# EAGLE board Main (EAGLE 9.6.2), part 1 of 2
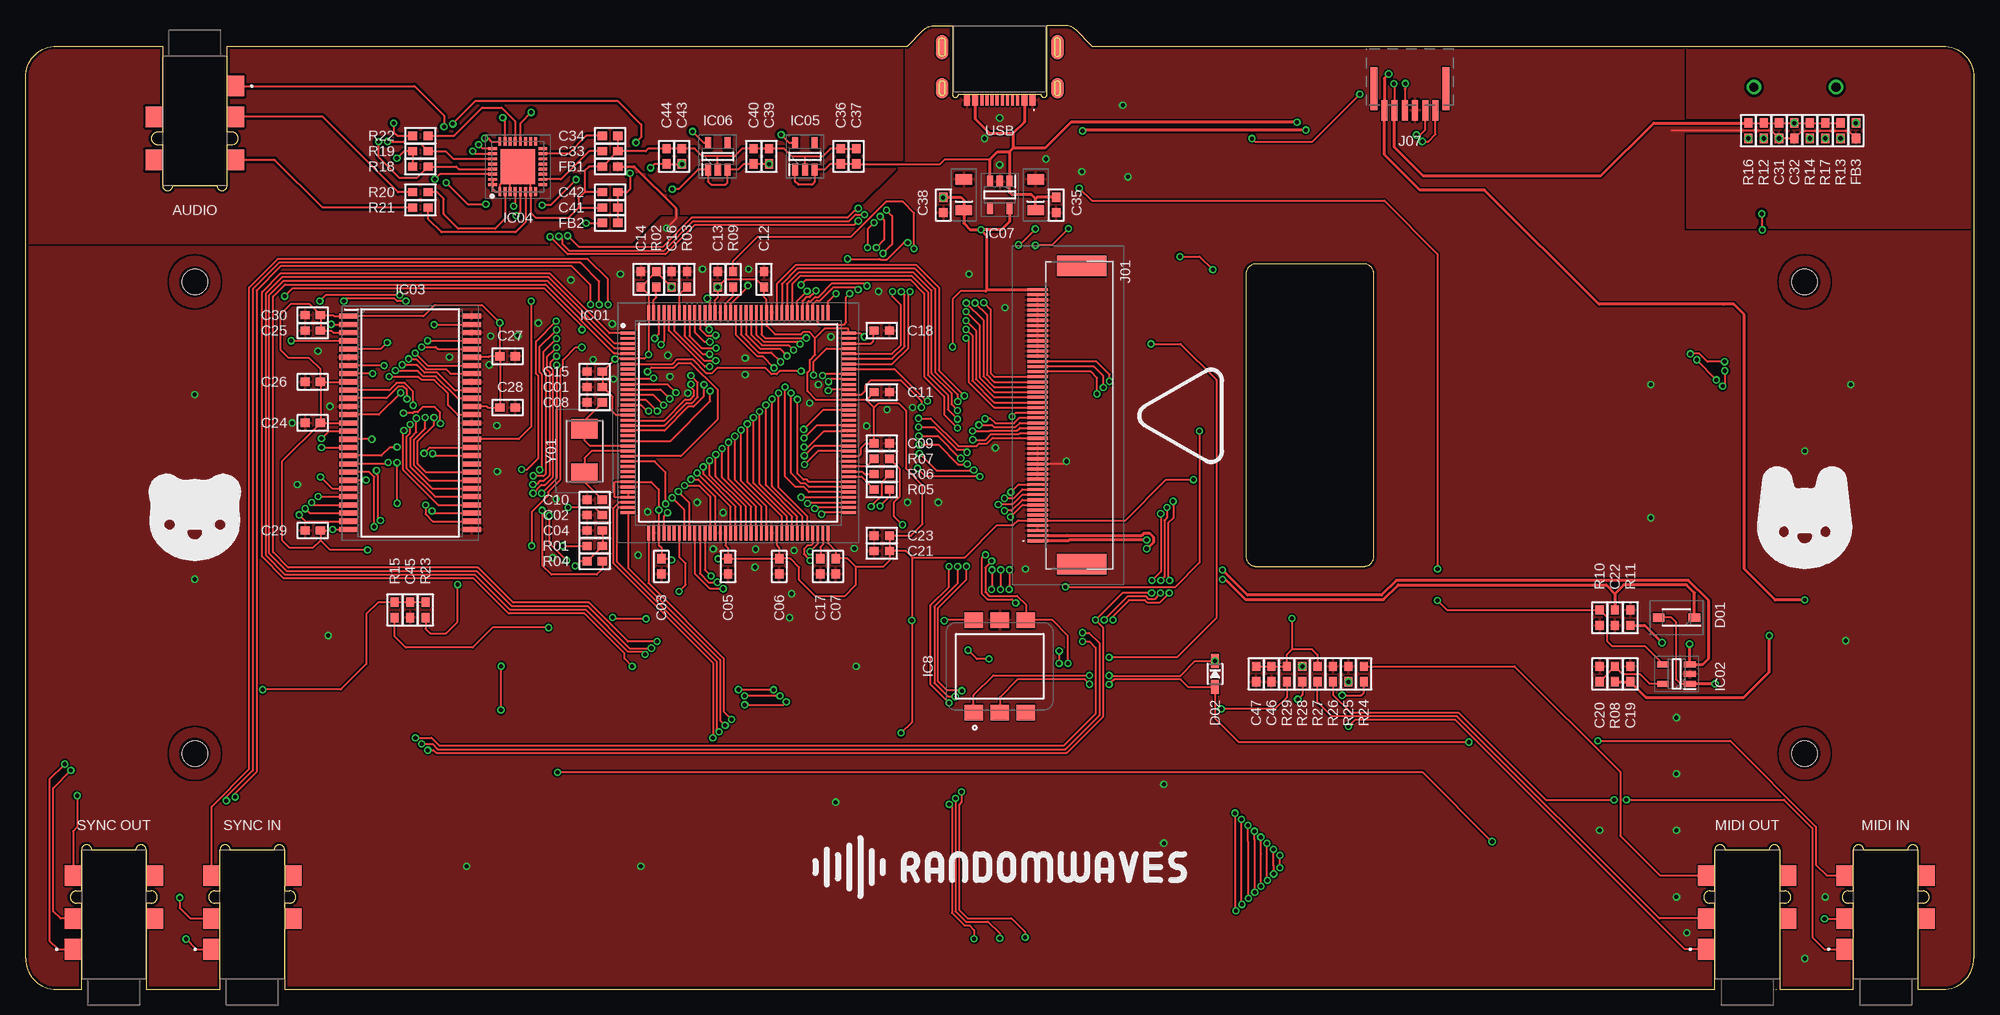
[diagram p5: board, top side]
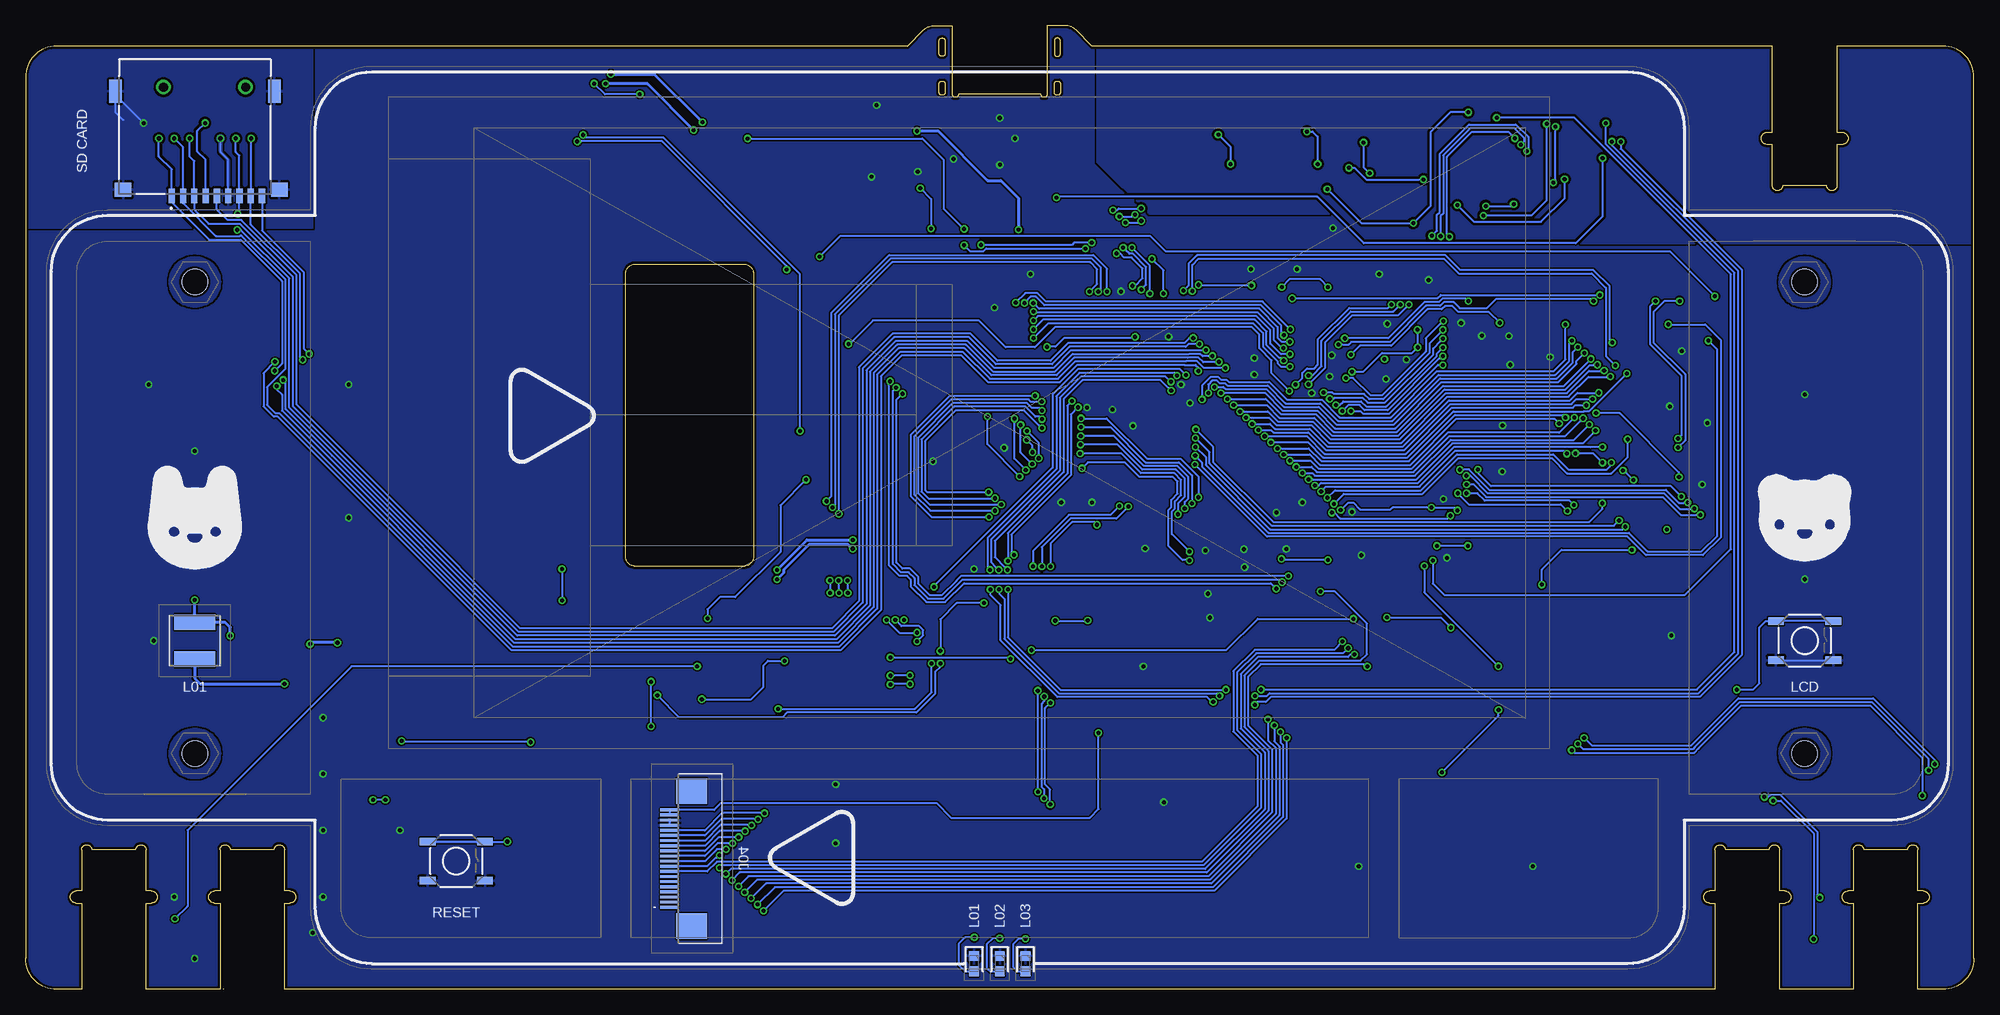
[diagram p6: board, bottom side, seen from below]

Size 190 x 94 mm. Coordinates in mm from the lower left corner, seen from the top.
Outline: 170.7,0 170.75,0
Outline: 119,42.25 arc90 120,41.25 130.5,41.25 arc90 131.5,42.25 131.5,69.75 arc90 130.5,70.75 120,70.75 arc90 119,69.75 119,42.25
Outline: 187,92 arc-90 190,89 190,3 arc-90 187,0 184.55,0 184.55,8.4 185.05,8.4 arc180 185.05,9.6 184.55,9.6 184.55,13.6 arc180 183.55,13.6 179.25,13.6 arc180 178.25,13.6 178.25,9.6 177.75,9.6 arc180 177.75,8.4 178.25,8.4 178.25,0 171.05,0 171.05,8.4 171.55,8.4 arc180 171.55,9.6 171.05,9.6 171.05,13.6 arc180 170.05,13.6 165.75,13.6 arc180 164.75,13.6 164.75,9.6 164.25,9.6 arc180 164.25,8.4 164.75,8.4 164.75,0 25.25,0 25.25,8.4 25.75,8.4 arc180 25.75,9.6 25.25,9.6 25.25,13.6 arc180 24.25,13.6 19.95,13.6 arc180 18.95,13.6 18.95,9.6 18.45,9.6 arc180 18.45,8.4 18.95,8.4 18.95,0 11.75,0 11.75,8.4 12.25,8.4 arc180 12.25,9.6 11.75,9.6 11.75,13.6 arc180 10.75,13.6 6.45,13.6 arc180 5.45,13.6 5.45,9.6 4.95,9.6 arc180 4.95,8.4 5.45,8.4 5.45,0 3,0 arc-90 0,3 0,89 arc-90 3,92 13.35,92 13.35,83.6 12.85,83.6 arc180 12.85,82.4 13.35,82.4 13.35,78.4 arc180 14.35,78.4 18.65,78.4 arc180 19.65,78.4 19.65,82.4 20.15,82.4 arc180 20.15,83.6 19.65,83.6 19.65,92 86,92 87.59,93.59 arc-45 88.58,94 90.38,94 90.38,87.3 arc90 90.68,87 arc90 90.98,87.3 99.02,87.3 arc90 99.32,87 arc90 99.62,87.3 99.62,94 101.42,94 arc-45 102.41,93.59 104,92 187,92
Copper layers (1*16): Top 0.035mm / dielectric 1.5mm / Bottom 0.035mm
Design rules "ITEADstudio_DRC": minimum track width 6mil, minimum drill 12mil, track to track 6mil, track to pad 6mil, pad to pad 6mil, via to via 6mil, smd to smd 0mil, copper to edge 10mil, drill to drill 10mil, minimum pad ring 10mil, minimum via ring 6mil, stop-mask expansion 2mil, vias tented up to drill 100mil, thermal gap 10mil
Holes 2.5 mm at 173.5,69 16.5,69 173.5,23 16.5,23

## Footprints (pad centres in the part's own frame; a part is rotated, then mirrored left to right if it is on the bottom)
CAP-0603 = smd 0.9 x 0.8: P$1 -0.75,0; P$2 0.75,0
CAP-POL-1206 = smd 1 x 1.6: P$1 -1.5,0; P$2 1.5,0
SOD3716X135N = smd 1.15 x 0.8: 1 -1.75,0; 2 1.75,0
SOD-323 = smd 1.35 x 0.8: A 1.27,0; C -1.27,0
RES-0603 = smd 0.9 x 0.8: P$1 -0.75,0; P$2 0.75,0
QFP50P2200X2200X160-144N = smd 1.475 x 0.275: 1 -10.738,8.75; 2 -10.738,8.25; 3 -10.738,7.75; 4 -10.738,7.25; 5 -10.738,6.75; 6 -10.738,6.25; 7 -10.738,5.75; 8 -10.738,5.25; 9 -10.738,4.75; 10 -10.738,4.25; 11 -10.738,3.75; 12 -10.738,3.25; 13 -10.738,2.75; 14 -10.738,2.25; 15 -10.738,1.75; 16 -10.738,1.25; 17 -10.738,0.75; 18 -10.738,0.25; 19 -10.738,-0.25; 20 -10.738,-0.75; 21 -10.738,-1.25; 22 -10.738,-1.75; 23 -10.738,-2.25; 24 -10.738,-2.75; 25 -10.738,-3.25; 26 -10.738,-3.75; 27 -10.738,-4.25; 28 -10.738,-4.75; 29 -10.738,-5.25; 30 -10.738,-5.75; 31 -10.738,-6.25; 32 -10.738,-6.75; 33 -10.738,-7.25; 34 -10.738,-7.75; 35 -10.738,-8.25; 36 -10.738,-8.75; 73 10.738,-8.75; 74 10.738,-8.25; 75 10.738,-7.75; 76 10.738,-7.25; 77 10.738,-6.75; 78 10.738,-6.25; 79 10.738,-5.75; 80 10.738,-5.25; 81 10.738,-4.75; 82 10.738,-4.25; 83 10.738,-3.75; 84 10.738,-3.25; 85 10.738,-2.75; 86 10.738,-2.25; 87 10.738,-1.75; 88 10.738,-1.25; 89 10.738,-0.75; 90 10.738,-0.25; 91 10.738,0.25; 92 10.738,0.75; 93 10.738,1.25; 94 10.738,1.75; 95 10.738,2.25; 96 10.738,2.75; 97 10.738,3.25; 98 10.738,3.75; 99 10.738,4.25; 100 10.738,4.75; 101 10.738,5.25; 102 10.738,5.75; 103 10.738,6.25; 104 10.738,6.75; 105 10.738,7.25; 106 10.738,7.75; 107 10.738,8.25; 108 10.738,8.75 | smd 0.275 x 1.475: 37 -8.75,-10.738; 38 -8.25,-10.738; 39 -7.75,-10.738; 40 -7.25,-10.738; 41 -6.75,-10.738; 42 -6.25,-10.738; 43 -5.75,-10.738; 44 -5.25,-10.738; 45 -4.75,-10.738; 46 -4.25,-10.738; 47 -3.75,-10.738; 48 -3.25,-10.738; 49 -2.75,-10.738; 50 -2.25,-10.738; 51 -1.75,-10.738; 52 -1.25,-10.738; 53 -0.75,-10.738; 54 -0.25,-10.738; 55 0.25,-10.738; 56 0.75,-10.738; 57 1.25,-10.738; 58 1.75,-10.738; 59 2.25,-10.738; 60 2.75,-10.738; 61 3.25,-10.738; 62 3.75,-10.738; 63 4.25,-10.738; 64 4.75,-10.738; 65 5.25,-10.738; 66 5.75,-10.738; 67 6.25,-10.738; 68 6.75,-10.738; 69 7.25,-10.738; 70 7.75,-10.738; 71 8.25,-10.738; 72 8.75,-10.738; 109 8.75,10.738; 110 8.25,10.738; 111 7.75,10.738; 112 7.25,10.738; 113 6.75,10.738; 114 6.25,10.738; 115 5.75,10.738; 116 5.25,10.738; 117 4.75,10.738; 118 4.25,10.738; 119 3.75,10.738; 120 3.25,10.738; 121 2.75,10.738; 122 2.25,10.738; 123 1.75,10.738; 124 1.25,10.738; 125 0.75,10.738; 126 0.25,10.738; 127 -0.25,10.738; 128 -0.75,10.738; 129 -1.25,10.738; 130 -1.75,10.738; 131 -2.25,10.738; 132 -2.75,10.738; 133 -3.25,10.738; 134 -3.75,10.738; 135 -4.25,10.738; 136 -4.75,10.738; 137 -5.25,10.738; 138 -5.75,10.738; 139 -6.25,10.738; 140 -6.75,10.738; 141 -7.25,10.738; 142 -7.75,10.738; 143 -8.25,10.738; 144 -8.75,10.738
SOT95P280X100-5N = smd 1.15 x 0.6: 1 -1.3,0.95; 2 -1.3,0; 3 -1.3,-0.95; 4 1.3,-0.95; 5 1.3,0.95
SOP80P1176X120-54N = smd 1.8 x 0.5: 1 -6,10.4; 2 -6,9.6; 3 -6,8.8; 4 -6,8; 5 -6,7.2; 6 -6,6.4; 7 -6,5.6; 8 -6,4.8; 9 -6,4; 10 -6,3.2; 11 -6,2.4; 12 -6,1.6; 13 -6,0.8; 14 -6,0; 15 -6,-0.8; 16 -6,-1.6; 17 -6,-2.4; 18 -6,-3.2; 19 -6,-4; 20 -6,-4.8; 21 -6,-5.6; 22 -6,-6.4; 23 -6,-7.2; 24 -6,-8; 25 -6,-8.8; 26 -6,-9.6; 27 -6,-10.4; 28 6,-10.4; 29 6,-9.6; 30 6,-8.8; 31 6,-8; 32 6,-7.2; 33 6,-6.4; 34 6,-5.6; 35 6,-4.8; 36 6,-4; 37 6,-3.2; 38 6,-2.4; 39 6,-1.6; 40 6,-0.8; 41 6,0; 42 6,0.8; 43 6,1.6; 44 6,2.4; 45 6,3.2; 46 6,4; 47 6,4.8; 48 6,5.6; 49 6,6.4; 50 6,7.2; 51 6,8; 52 6,8.8; 53 6,9.6; 54 6,10.4
QFN50P500X500X90-33N = smd 0.85 x 0.275: 1 -2.45,1.75; 2 -2.45,1.25; 3 -2.45,0.75; 4 -2.45,0.25; 5 -2.45,-0.25; 6 -2.45,-0.75; 7 -2.45,-1.25; 8 -2.45,-1.75; 17 2.45,-1.75; 18 2.45,-1.25; 19 2.45,-0.75; 20 2.45,-0.25; 21 2.45,0.25; 22 2.45,0.75; 23 2.45,1.25; 24 2.45,1.75 | smd 0.275 x 0.85: 9 -1.75,-2.45; 10 -1.25,-2.45; 11 -0.75,-2.45; 12 -0.25,-2.45; 13 0.25,-2.45; 14 0.75,-2.45; 15 1.25,-2.45; 16 1.75,-2.45; 25 1.75,2.45; 26 1.25,2.45; 27 0.75,2.45; 28 0.25,2.45; 29 -0.25,2.45; 30 -0.75,2.45; 31 -1.25,2.45; 32 -1.75,2.45 | smd 3.4 x 3.4: 33 0,0
SOT95P285X130-5N = smd 1.15 x 0.6: 1 -1.3,0.95; 2 -1.3,0; 3 -1.3,-0.95; 4 1.3,-0.95; 5 1.3,0.95
SMT-6PIN-(LEAD-BEND) = smd 1.78 x 1.52: 1 -2.54,-4.505; 2 0,-4.505; 3 2.54,-4.505; 4 2.54,4.505; 5 0,4.505; 6 -2.54,4.505
541045031 = smd 0.3 x 2: 1 -12.25,0.8; 2 -11.75,0.8; 3 -11.25,0.8; 4 -10.75,0.8; 5 -10.25,0.8; 6 -9.75,0.8; 7 -9.25,0.8; 8 -8.75,0.8; 9 -8.25,0.8; 10 -7.75,0.8; 11 -7.25,0.8; 12 -6.75,0.8; 13 -6.25,0.8; 14 -5.75,0.8; 15 -5.25,0.8; 16 -4.75,0.8; 17 -4.25,0.8; 18 -3.75,0.8; 19 -3.25,0.8; 20 -2.75,0.8; 21 -2.25,0.8; 22 -1.75,0.8; 23 -1.25,0.8; 24 -0.75,0.8; 25 -0.25,0.8; 26 0.25,0.8; 27 0.75,0.8; 28 1.25,0.8; 29 1.75,0.8; 30 2.25,0.8; 31 2.75,0.8; 32 3.25,0.8; 33 3.75,0.8; 34 4.25,0.8; 35 4.75,0.8; 36 5.25,0.8; 37 5.75,0.8; 38 6.25,0.8; 39 6.75,0.8; 40 7.25,0.8; 41 7.75,0.8; 42 8.25,0.8; 43 8.75,0.8; 44 9.25,0.8; 45 9.75,0.8; 46 10.25,0.8; 47 10.75,0.8; 48 11.25,0.8; 49 11.75,0.8; 50 12.25,0.8 | smd 2 x 4.8: 51 -14.55,-3.5; 52 14.55,-3.5
L-KLS1-TF-003-H1.85-R = smd 0.6 x 1.4: 1 2.25,10.6; 2 1.15,10.6; 3 0.05,10.6; 4 -1.05,10.6; 5 -2.15,10.6; 6 -3.25,10.6; 7 -4.35,10.6; 8 -5.45,10.6; 9 -6.55,10.6 | smd 1.6 x 1.4: 10 -8.25,10; 13 7,10 | smd 1.2 x 2.2: 11 -7.75,0.4; 12 7.75,0.4 | drill 0.9 pad 1.4: 14 3.05,0; 15 -4.95,0
SJ3503SMTTR = smd 2 x 1.65: 1 2.9,3.975; 2 10.1,3.975; 3 5.9,3.975; 4 10.1,-3.975; 5 5.9,-3.975
68712014022 = smd 0.275 x 1.8: 1 -4.75,2.72; 2 -4.25,2.72; 3 -3.75,2.72; 4 -3.25,2.72; 5 -2.75,2.72; 6 -2.25,2.72; 7 -1.75,2.72; 8 -1.25,2.72; 9 -0.75,2.72; 10 -0.25,2.72; 11 0.25,2.72; 12 0.75,2.72; 13 1.25,2.72; 14 1.75,2.72; 15 2.25,2.72; 16 2.75,2.72; 17 3.25,2.72; 18 3.75,2.72; 19 4.25,2.72; 20 4.75,2.72 | smd 2.5 x 3: 21 -6.58,0.56; 22 6.58,0.56
HFW6R-2STE1LF = smd 0.6 x 2: P$1 -2.5,3.25; P$2 -1.5,3.25; P$3 -0.5,3.25; P$4 0.5,3.25; P$5 1.5,3.25; P$6 2.5,3.25 | smd 0.7 x 4.2: P$7 -3.5,1.15; P$8 3.5,1.15
NRS5024T4R7MMGJ = smd 1.5 x 4: 1 -1.8,0; 2 1.8,0
LEDC1608X80N = smd 0.95 x 0.95: 1 -0.75,0; 2 0.75,0
TACTILE-SWITCH-SMD = smd 1.524 x 0.762: 1 -2.794,1.905; 2 2.794,1.905; 3 -2.794,-1.905; 4 2.794,-1.905
2169900001 = smd 0.6 x 1.1: A1 -3.2,7.25; A4 -2.4,7.25; A9 2.4,7.25; A12 3.2,7.25 | smd 0.3 x 1.1: A5 -1.25,7.25; A6 -0.25,7.25; A7 0.25,7.25; A8 1.25,7.25; B5 1.75,7.25; B6 0.75,7.25; B7 -0.75,7.25; B8 -1.75,7.25 | smd 1.2 x 2: P$1 -5.62,6.1; P$2 5.62,6.1 | smd 1.2 x 2.4: P$3 -5.62,2.1; P$4 5.62,2.1
ABM78000MHZD2YT = smd 1.9 x 2.6: 1 -2.15,0; 2 2.15,0

## Placement (x,y rotation side)
C1  0.1uF  [CAP-0603]  55.5,58.75 0 top
C2  0.1uF  [CAP-0603]  55.5,46.25 0 top
C3  0.1uF  [CAP-0603]  62,41.25 90 top
C4  0.1uF  [CAP-0603]  55.5,44.75 0 top
C5  0.1uF  [CAP-0603]  68.5,41.25 90 top
C6  0.1uF  [CAP-0603]  73.5,41.25 90 top
C7  0.1uF  [CAP-0603]  79,41.25 90 top
C8  33pF  [CAP-0603]  55.5,57.25 0 top
C9  0.1uF  [CAP-0603]  83.5,53.25 180 top
C10  33pF  [CAP-0603]  55.5,47.75 0 top
C11  0.1uF  [CAP-0603]  83.5,58.25 180 top
C12  0.1uF  [CAP-0603]  72,69.25 270 top
C13  0.1uF  [CAP-0603]  67.5,69.25 270 top
C14  0.1uF  [CAP-0603]  60,69.25 270 top
C15  0.1uF  [CAP-0603]  55.5,60.25 0 top
C16  4.7uF  [CAP-0603]  63,69.25 270 top
C17  2.2uF  [CAP-0603]  77.5,41.25 90 top
C18  2.2uF  [CAP-0603]  83.5,64.25 180 top
C19  10uF  [CAP-0603]  156.5,30.75 270 top
C20  1uF  [CAP-0603]  153.5,30.75 270 top
C21  0.1uF  [CAP-0603]  83.5,42.75 180 top
C22  1uF  [CAP-0603]  155,36.25 270 top
C23  4.7uF  [CAP-0603]  83.5,44.25 180 top
C24  0.1uF  [CAP-0603]  28,55.25 180 top
C25  0.1uF  [CAP-0603]  28,64.25 180 top
C26  0.1uF  [CAP-0603]  28,59.25 180 top
C27  0.1uF  [CAP-0603]  47,61.75 0 top
C28  0.1uF  [CAP-0603]  47,56.75 0 top
C29  0.1uF  [CAP-0603]  28,44.75 180 top
C30  0.1uF  [CAP-0603]  28,65.75 180 top
C31  0.1uF  [CAP-0603]  171,83.75 270 top
C32  4.7uF  [CAP-0603]  172.5,83.75 270 top
C33  0.1uF  [CAP-0603]  57,81.75 180 top
C34  0.1uF  [CAP-0603]  57,83.25 180 top
C35  0.1uF  [CAP-0603]  100.5,76.5 90 top
C36  0.1uF  [CAP-0603]  79.5,81.25 270 top
C37  2.2uF  [CAP-0603]  81,81.25 270 top
C38  0.1uF  [CAP-0603]  89.5,76.5 90 top
C39  0.1uF  [CAP-0603]  72.5,81.25 270 top
C40  2.2uF  [CAP-0603]  71,81.25 270 top
C41  0.1uF  [CAP-0603]  57,76.25 0 top
C42  2.2uF  [CAP-0603]  57,77.75 0 top
C43  0.1uF  [CAP-0603]  64,81.25 270 top
C44  2.2uF  [CAP-0603]  62.5,81.25 270 top
C45  0.1uF  [CAP-0603]  37.5,37 90 top
C46  0.1uF  [CAP-0603]  121.5,30.75 270 top
C47  4.7uF  [CAP-0603]  120,30.75 270 top
CP1  10uF  [CAP-POL-1206]  98.5,77.5 90 top
CP2  10uF  [CAP-POL-1206]  91.5,77.5 90 top
D1  MBR0520LT3G  [SOD3716X135N]  161,36.25 180 top
D2  1N4148  [SOD-323]  116,30.75 270 top
FB01  600  [RES-0603]  57,80.25 0 top
FB02  600  [RES-0603]  57,74.75 0 top
FB03  600  [RES-0603]  178.5,83.75 270 top
IC1  STM32H730ZBT6  [QFP50P2200X2200X160-144N]  69.5,55.25 0 top
IC2  MP3302DJ-LF-Z  [SOT95P280X100-5N]  161,30.75 180 top
IC3  IS42S16800F-7TLI  [SOP80P1176X120-54N]  37.5,55.25 0 top
IC4  SGTL5000XNAA3  [QFN50P500X500X90-33N]  48,80.25 90 top
IC5  AP7365-33WG-7  [SOT95P285X130-5N]  76,81.25 90 top
IC6  AP7365-18WG-7  [SOT95P285X130-5N]  67.5,81.25 90 top
IC7  AP7365-33WG-7  [SOT95P285X130-5N]  95,77.5 270 top
IC8  H11L1SM  [SMT-6PIN-(LEAD-BEND)]  95,31.5 0 top
J1  54104-5031  [541045031]  99.5,56 90 top
J2  L-KLS1-TF-003-H1.85-R  [L-KLS1-TF-003-H1.85-R]  173.5,88 180 bottom
J3  SJ-3503-SMT-TR  [SJ3503SMTTR]  16.5,91 270 top
J4  68712014022  [68712014022]  124.5,12.75 90 bottom
J5  SJ-3503-SMT-TR  [SJ3503SMTTR]  22.1,1 90 top
J6  SJ-3503-SMT-TR  [SJ3503SMTTR]  8.6,1 90 top
J7  HFW6R-2STE1LF  [HFW6R-2STE1LF]  135,89 180 top
J8  SJ-3503-SMT-TR  [SJ3503SMTTR]  167.9,1 90 top
J9  SJ-3503-SMT-TR  [SJ3503SMTTR]  181.4,1 90 top
L1  NRS5024T4R7MMGJ  [NRS5024T4R7MMGJ]  173.5,34 90 bottom
LED1  150060RS75000  [LEDC1608X80N]  97.5,2.5 270 bottom
LED2  150060YS75000  [LEDC1608X80N]  95,2.5 270 bottom
LED3  150060VS75000  [LEDC1608X80N]  92.5,2.5 270 bottom
R1  220  [RES-0603]  55.5,43.25 0 top
R2  10K  [RES-0603]  61.5,69.25 270 top
R3  10K  [RES-0603]  64.5,69.25 270 top
R4  10K  [RES-0603]  55.5,41.75 0 top
R5  220  [RES-0603]  83.5,48.75 180 top
R6  220  [RES-0603]  83.5,50.25 180 top
R7  220  [RES-0603]  83.5,51.75 180 top
R8  10  [RES-0603]  155,30.75 270 top
R9  10K  [RES-0603]  69,69.25 270 top
R10  100K  [RES-0603]  153.5,36.25 270 top
R11  10  [RES-0603]  156.5,36.25 270 top
R12  47K  [RES-0603]  169.5,83.75 270 top
R13  47K  [RES-0603]  177,83.75 270 top
R14  47K  [RES-0603]  174,83.75 270 top
R15  220  [RES-0603]  36,37 90 top
R16  47K  [RES-0603]  168,83.75 270 top
R17  47K  [RES-0603]  175.5,83.75 270 top
R18  2.2K  [RES-0603]  38.5,80.25 0 top
R19  2.2K  [RES-0603]  38.5,81.75 0 top
R20  0  [RES-0603]  38.5,77.75 180 top
R21  0  [RES-0603]  38.5,76.25 180 top
R22  100  [RES-0603]  38.5,83.25 180 top
R23  10K  [RES-0603]  39,37 270 top
R24  47  [RES-0603]  130.5,30.75 270 top
R25  0  [RES-0603]  129,30.75 270 top
R26  0  [RES-0603]  127.5,30.75 270 top
R27  47  [RES-0603]  126,30.75 270 top
R28  220  [RES-0603]  124.5,30.75 270 top
R29  470  [RES-0603]  123,30.75 270 top
S1  RST  [TACTILE-SWITCH-SMD]  148,12.5 0 bottom
S2  BUTTON  [TACTILE-SWITCH-SMD]  16.5,34 0 bottom
USB1  216990-0001  [2169900001]  95,94 180 top
Y1  ABM7-8.000MHZ-D2Y-T  [ABM78000MHZD2YT]  54.5,52.5 270 top

## Tracks (layer width: path | path; a pad name or v marks a point on that pad's centre or on a via)
1V8  (via drill 0.4)
  Top 0.203: C43.P$2 C44.P$2 61.32,80.5 v60.95,80.13 | IC6.5 66.17,82.55 v65.05,83.67 | v53.68,78.99 51.18,76.49 v50.37,76.49 | IC4.30 40.39,79.5 v39.91,79.02
  Bottom 0.203: v65.05,83.67 64.49,83.67 64,83.18 C43.P$2 | v50.37,76.49 48.75,74.87 42.21,74.87 39.91,77.17 v39.91,79.02 | v60.95,80.13 60.4,80.13 59.26,78.99 v53.68,78.99
  other vias: 64,80.5
3V3  (via drill 0.4)
  Top 0.2: R16.P$1 R12.P$1 C31.P$1 C32.P$1 R14.P$1 R17.P$1 R13.P$1
  Top 0.203: IC1.62 73.25,43.32 73.5,43.07 C6.P$2 | IC1.72 78.25,43.51 79,42.76 C7.P$2 80.15,42.01 80.96,41.2 | C21.P$1 C23.P$1 86.35,44.25 87.49,45.39 87.49,49.16 85.84,50.81 85.84,56.44 85.11,57.17 83.77,57.17 83.76,57.16 83.16,57.16 82.75,56.75 | C21.P$1 84.25,41.82 83.63,41.2 80.96,41.2 | IC1.52 68.25,43.29 68.5,43.04 C5.P$2 | IC1.17 57.6,56 57.25,56.35 57.25,57.8 56.3,58.75 C1.P$2 C15.P$2 v57.47,61.47 57.5,61.5 IC1.6 60.35,61.5 v60.75,61.9 IC1.144 60.75,67.75 C14.P$2 R2.P$1 C16.P$2 | IC1.32 IC1.33 57.46,48 57.38,48.08 57.38,49.36 57.52,49.5 IC1.30 61.01,49.5 61.75,48.76 v61.75,46.74 IC1.39 61.75,43.33 62,43.08 C3.P$2 62.86,42 v62.99,41.87 | IC1.131 67.25,67.24 67.51,67.5 C13.P$2 68.26,69.26 71.24,69.26 C12.P$2 72,67.53 72.25,67.28 IC1.121 72.25,64.72 73.07,63.9 75.63,63.9 75.88,64.15 76.38,64.15 77,63.53 | C11.P$2 82,57.5 | 82,57.5 IC1.95 77.08,57.5 76.25,58.34 76.25,60.16 76.5,60.41 76.5,61.39 77,61.89 77,63.53 | C21.P$1 85.84,42.75 86.42,42.17 | C2.P$2 55.51,46.99 v52.91,46.99 | C5.P$2 C6.P$2 | v67.53,41.99 v67.54,42 C5.P$2 | IC1.84 81.26,52 81.47,52.21 81.47,52.79 81.93,53.25 C9.P$2 82.75,56.75 | 80.96,41.2 80.95,41.19 80.95,39.42 79.86,38.33 77.03,38.33 75.43,39.93 75.43,41.16 74.59,42 C6.P$2 | v50.38,46.72 50.38,41.35 51.28,40.45 55.7,40.45 56.25,41 R4.P$2 | 77,63.53 77.47,64 77.48,64 77.92,64.44 80.24,64.44 IC1.108 81.44,64 v81.8,63.65 | 86.42,42.17 86.47,42.12 91.6,42.12 94.75,45.27 96.31,45.27 96.79,45.75 J1.5 107.25,45.75 111.21,49.71 v113.88,49.71 | 93.62,68.08 91.16,68.08 90.4,67.32 v90.4,62.67 | 82.75,56.75 82,57.5 | C30.P$1 C25.P$1 29.81,64.25 30.01,64.05 IC3.3
  Top 0.203: C30.P$1 30,65.75 30.1,65.65 IC3.1 38.81,65.65 39.9,66.74 44.51,66.74 v46.24,65.01 C27.P$1 | C27.P$1 45.21,61.75 45.11,61.65 IC3.49 | C27.P$1 C28.P$1 45.06,56.75 44.96,56.85 IC3.43 | 28.75,43.8 C29.P$1 29.84,44.75 v29.94,44.85 IC3.27 | 28.75,43.8 28,43.05 25.75,43.05 25.03,43.77 25.03,51.53 C24.P$1 | C26.P$1 C24.P$1 | C26.P$1 28.75,60.48 27.65,61.58 25.64,61.58 24.89,62.33 24.89,65.86 25.9,66.87 27.63,66.87 C30.P$1 | 86.42,42.17 v86.42,35.97 86.42,26.05 v85.37,25 | R18.P$1 R19.P$1 36.89,81.75 v36.21,81.07 | v89.47,77.22 C38.P$2 | v133.45,88.33 133.51,88.27 J7.P$5 | C26.P$1 IC3.9 | C24.P$1 IC3.14 | R23.P$2 39,35.16 39.45,34.71 41,34.71 42.13,35.84 v42.13,39.47 | v33.34,42.85 29.7,42.85 28.75,43.8 | C47.P$1 C46.P$1 R29.P$1 123,32.66 123.51,33.17 | 123.51,33.17 125.45,33.17 126,32.62 R27.P$1 | v123.5,36.17 123.5,33.18 123.51,33.17 | IC8.6 89.64,36.01 v89.59,35.95
  Top 0.305: v124.85,83.82 103.16,83.82 v103.07,83.73 | v93.16,74.09 93.72,73.53 93.72,68.18 | 93.72,68.18 93.62,68.08 | IC7.5 95.95,74.86 95.18,74.09 v93.16,74.09 | v93.16,74.09 92.12,74.09 91.5,74.71 CP2.P$1 91.51,76.96 91.22,77.25 C38.P$2 | 93.72,68.18 93.79,68.25 J1.50 | R16.P$1 158.77,84.5 153.62,79.35 136.28,79.35 133.5,82.13 J7.P$5
  Bottom 0.2: 122.84,17.5 J4.20 J4.19 | J2.4 172.45,80.6 172.44,80.61 172.44,80.91 173.25,81.72 173.25,83.75 C32.P$1
  Bottom 0.203: v62.99,41.87 67.41,41.87 v67.53,41.99 | v50.38,46.72 50.65,46.99 v52.91,46.99 56.7,46.99 56.89,46.8 59.85,46.8 60.53,47.48 61.01,47.48 v61.75,46.74 | v60.75,61.9 59.86,62.79 56.81,62.79 53.27,66.33 51.88,66.33 51.55,66.66 50.87,66.66 50.28,66.07 47.3,66.07 v46.24,65.01 | v85.37,25 85.37,17.59 86.22,16.74 99.77,16.74 101.19,18.16 122.18,18.16 122.84,17.5 | v36.21,81.07 36.21,75.38 38.82,72.77 59.49,72.77 64.02,77.3 89.39,77.3 v89.47,77.22 | v81.8,63.65 81.94,63.5 88.74,63.5 89.57,62.67 v90.4,62.67 | v42.13,39.47 42.13,40.93 40.21,42.85 v33.34,42.85 | v113.88,49.71 116.4,47.19 116.4,42.67 120.81,38.26 122.29,38.26 123.5,37.05 v123.5,36.17 | v89.59,35.95 86.44,35.95 v86.42,35.97 | C16.P$2 63.75,69.25 66.75,69.25 C13.P$2
  Bottom 0.305: v103.07,83.73 101.01,83.73 96.18,78.9 94.89,78.9 93.16,77.17 v93.16,74.09 | v124.85,83.82 129.36,88.33 v133.45,88.33
  other vias: 172.5,84.5 63,68.5 67.5,68.5
5V  (via drill 0.4)
  Top 0.203: IC5.1 75.05,78.79 75.36,78.48 76.67,78.48 76.95,78.76 IC5.3 77.92,79.95 78.47,80.5 C36.P$2 C37.P$2 89.18,80.5 89.64,80.96 94.05,80.96
  Top 0.305: 95.95,81.7 IC7.1 95.95,77.75 96.2,77.5 98.11,77.5 98.5,77.11 | 96.3,82.05 95.95,81.7 | IC7.3 94.05,80.96 94.79,81.7 95.95,81.7 | CP1.P$1 98.5,77.11 | C35.P$2 98.64,77.25 98.5,77.11 | 96.3,82.05 99.41,82.05 101.93,84.57 v124,84.57 | v132.93,89.28 132.5,88.85 J7.P$6 132.5,81.43 135.96,77.97 142.28,77.97 153.43,66.82 165.6,66.82 166.57,66.82 167.59,65.8 167.59,41 170.62,37.97 v173.51,37.97 | USB1.A4 97.4,84.6 96.3,83.5 | 96.3,83.5 96.3,82.05 | USB1.A9 92.6,84.92 94.02,83.5 96.3,83.5 | R8.P$2 C19.P$2 158.03,28.47 167.57,28.47 170.05,30.95 v170.05,34.49
  Bottom 0.305: v132.93,89.28 128.71,89.28 v124,84.57 | v170.05,34.49 170.05,35.31 170.54,35.8 L1.2 v173.5,37.96 v173.51,37.97
ANA_3V3  (via drill 0.4)
  Top 0.203: FB02.P$2 C41.P$2 C42.P$2 58.65,77.75 58.93,78.03 v58.93,79.6 | v41.66,84.42 43.91,86.67 57.72,86.67 60.04,84.35 60.04,83.12 v59.52,82.6 | v47.83,75.48 48.25,75.9 IC4.5
  Bottom 0.203: v59.52,82.6 59.52,80.19 v58.93,79.6 | v47.83,75.48 43.13,75.48 41.66,76.95 v41.66,84.42
BL_EN  (via drill 0.4)
  Top 0.203: R9.P$1 69,71.02 71.4,73.42 80.52,73.42 83.92,76.83 85.55,76.83 86.64,75.73 v86.64,72.24 | v102.75,78.15 103.97,76.93 132.5,76.93 137.7,71.73 v137.7,40.99 | v101.69,74.19 100.07,72.57 v98.47,72.57 | IC2.4 157.94,33.46 154.72,33.46 154.24,33.94 154.24,36.26 R10.P$1 138.59,37.01 v137.67,37.93
  Bottom 0.203: v102.75,78.15 101.69,77.09 v101.69,74.19 | v98.47,72.57 97.9,72 96.58,72 96.33,72.25 86.66,72.25 v86.64,72.24 | v137.7,40.99 137.7,37.96 v137.67,37.93
BL_GND  (via drill 0.4)
  Top 0.305: R11.P$2 157.9,35.5 v159.59,33.81 | v162.27,33.67 162.27,31.73 IC2.3 163.58,31.7 164.14,32.26 164.14,37.93 162.17,39.9 133.67,39.9 132.23,38.46 119.17,38.46 v116.73,40.9 | v109.33,43.83 101.79,43.83 101.71,43.75 J1.1
  Bottom 0.305: v159.59,33.81 162.13,33.81 v162.27,33.67 | v116.73,40.9 113.8,43.83 v109.33,43.83
BL_IN
  Top 0.203: IC2.5 158.4,29.8 157.49,30.71 155.79,30.71 R8.P$1 C20.P$2
BL_SW  (via drill 0.4)
  Top 0.203: IC2.1 161.4,29.8 160.98,30.22 160.98,35.77 160.5,36.25 D1.2
  Top 0.305: v164.76,29.8 IC2.1
  Bottom 0.305: L1.1 173.5,30.34 172.96,29.8 v164.76,29.8
BL_VCC  (via drill 0.4)
  Top 0.305: D1.1 162.75,38.67 161.98,39.44 155.86,39.44 155,38.58 | 155,38.58 C22.P$1 | J1.2 101.56,44.25 101.6,44.29 108.86,44.29 109.06,44.49 109.6,44.49 109.99,44.1 109.99,43.56 109.6,43.17 109.53,43.17 v109.33,42.97 | v116.73,39.97 117.01,39.97 118.98,38 132.42,38 133.86,39.44 154.14,39.44 155,38.58
  Bottom 0.305: v109.33,42.97 109.53,43.17 109.6,43.17 109.8,43.37 113.61,43.37 116.07,40.91 116.07,40.63 v116.73,39.97
BOOT0
  Top 0.203: R3.P$2 63.75,67.75 IC1.138
BUTTON  (via drill 0.4)
  Top 0.203: IC1.22 62.9,53.5 66.75,57.36 v66.75,58.36 | v109.76,62.95 112.64,62.95 116.12,59.47 116.12,36.21 112.29,32.38 v105.67,32.38 | v93.95,32.22 92.77,32.22 v91.91,33.08 | v60.5,36.14 57.38,36.14 v57.26,36.27 | v51,35.27 45.53,35.27 43.6,33.34 37.07,33.34 36,34.41 R15.P$1
  Bottom 0.203: v66.75,58.36 68.49,60.1 68.49,61.35 69.68,62.54 69.68,63.87 70.41,64.6 89.6,64.6 91.57,62.63 94.42,62.63 97.03,65.24 107.38,65.24 109.67,62.95 v109.76,62.95 | v105.67,32.38 94.11,32.38 v93.95,32.22 | v91.91,33.08 87.04,33.08 72.9,33.08 69.84,36.14 v60.5,36.14 | v57.26,36.27 51.99,36.27 v51,35.27
CT0_SCL  (via drill 0.4)
  Top 0.203: IC1.34 57.87,47.5 57.28,46.92 57.28,41.59 67.02,31.85 v67.02,24.51 | v117.95,17.17 117.95,7.74 v118.03,7.66
  Bottom 0.2: 123.76,15.5 J4.16
  Bottom 0.203: v67.02,24.51 67.02,16.67 74.08,9.61 116.08,9.61 v118.03,7.66 | v117.95,17.17 118.3,17.17 118.32,17.19 122.07,17.19 123.76,15.5
CT0_SDO  (via drill 0.4)
  Top 0.203: IC1.35 57.87,47 57.64,46.77 57.64,41.73 67.38,32 67.38,25.37 v67.63,25.12 | v118.63,8.27 118.57,8.33 v118.57,16.58
  Bottom 0.2: 123.75,15 J4.15
  Bottom 0.203: v67.63,25.12 67.63,24.09 67.38,23.84 67.38,16.82 74.23,9.97 116.93,9.97 v118.63,8.27 | v118.57,16.58 118.92,16.58 118.94,16.6 122.15,16.6 123.75,15
CT1_SCL  (via drill 0.4)
  Top 0.203: IC1.36 58.76,41.12 67.73,32.15 67.73,26.22 v68.23,25.73 | v119.25,8.86 119.25,14.39 119.22,14.42 119.22,15.97 v119.19,16
  Bottom 0.2: 123.75,14.5 J4.14
  Bottom 0.203: v68.23,25.73 68.23,25.37 68.23,24.19 67.73,23.69 67.73,16.96 74.38,10.32 117.79,10.32 v119.25,8.86 | v119.19,16 119.55,16 119.58,16.03 122.22,16.03 123.75,14.5
CT1_SDO  (via drill 0.4)
  Top 0.203: IC1.37 60.75,39.63 68.09,32.29 68.09,27.08 v68.83,26.33 | v119.83,15.42 119.85,15.4 119.85,14.58 119.87,14.56 v119.87,9.45
  Bottom 0.2: 123.75,14 J4.13
  Bottom 0.203: v68.83,26.33 68.83,25.98 68.83,24.29 68.09,23.54 68.09,17.11 74.52,10.68 118.65,10.68 v119.87,9.45 | v119.83,15.42 120.19,15.42 120.2,15.44 122.31,15.44 123.75,14
CT2_D0  (via drill 0.4)
  Top 0.203: v59.16,31.49 58.4,32.25 58.4,32.76 54.5,36.66 47.11,36.66 43.69,40.08 25.18,40.08 23.06,42.19 23.06,68.03 24.85,69.81 51.13,69.81 56.95,64 IC1.1 | v120.48,10.05 120.48,13.19 120.45,13.22 v120.45,14.83 v120.46,14.83
  Bottom 0.2: 123.75,13.5 J4.12
  Bottom 0.203: v59.16,31.49 59.37,31.7 69.54,31.7 70.79,30.45 70.79,25.74 68.44,23.39 68.44,17.26 74.67,11.03 119.5,11.03 v120.48,10.05 | v120.46,14.83 122.41,14.83 123.75,13.5
CT2_D1  (via drill 0.4)
  Top 0.203: IC1.43 63.75,42.18 64.38,41.55 64.38,39.46 v63.72,38.8 | v121.11,10.64 121.06,10.69 v121.06,14.22
  Bottom 0.2: 123.74,13 J4.11
  Bottom 0.203: v63.72,38.8 62.3,38.8 59.18,35.68 59.18,32.69 59.81,32.06 69.69,32.06 71.15,30.6 71.15,25.59 68.8,23.25 68.8,17.41 74.82,11.39 120.36,11.39 v121.11,10.64 | v121.06,14.22 121.41,14.22 121.43,14.24 122.5,14.24 123.74,13
CT2_D2  (via drill 0.4)
  Top 0.203: IC1.3 57.44,63 50.98,69.46 25,69.46 23.41,67.88 23.41,42.34 25.33,40.43 43.84,40.43 47.26,37.01 54.65,37.01 58.74,32.91 59.45,32.91 | v60.41,32.66 60.16,32.91 59.45,32.91 | 59.45,32.91 | v121.72,11.24 121.72,12.06 121.71,12.06 121.71,13.61 v121.68,13.64
  Bottom 0.2: 123.74,12.5 J4.10
  Bottom 0.203: v60.41,32.66 60.79,32.66 61.04,32.41 69.83,32.41 71.5,30.74 71.5,25.45 69.15,23.1 69.15,17.55 74.96,11.74 121.22,11.74 v121.72,11.24 | v121.68,13.64 122.04,13.64 122.07,13.67 122.57,13.67 123.74,12.5
CT2_D3  (via drill 0.4)
  Top 0.203: IC1.4 57.44,62.5 50.84,69.1 25.14,69.1 23.77,67.73 23.77,42.49 25.47,40.79 43.98,40.79 47.4,37.37 54.8,37.37 58.89,33.27 v61.02,33.27 | v122.32,11.85 v122.32,13.06
  Bottom 0.2: 123.53,12 J4.9
  Bottom 0.203: v61.02,33.27 61.52,32.77 69.98,32.77 71.86,30.89 71.86,25.3 69.51,22.95 69.51,17.7 75.11,12.1 122.07,12.1 v122.32,11.85 | v122.32,13.06 122.57,12.81 122.72,12.81 123.53,12
CT2_D4  (via drill 0.4)
  Top 0.203: v61.58,33.93 58.74,33.93 54.94,37.72 47.55,37.72 44.13,41.14 25.62,41.14 24.13,42.64 24.13,67.58 25.29,68.75 50.69,68.75 57.36,62.08 57.72,62.08 57.8,62 IC1.5
  Bottom 0.2: 123.53,11.5 J4.8
  Bottom 0.203: v61.58,33.93 62.38,33.12 70.13,33.12 72.21,31.04 72.21,25.15 69.86,22.8 69.86,17.85 75.26,12.45 122.58,12.45 123.53,11.5
DAC_3V3  (via drill 0.4)
  Top 0.203: C39.P$2 C40.P$2 70.03,80.5 69.48,79.95 IC6.3 68.45,78.7 68.25,78.5 66.85,78.5 66.55,78.8 IC6.1 65.57,79.95 63.68,78.06 v63.06,78.06 | IC5.5 74.5,82.55 v73.69,83.36 | IC4.20 48.25,84.48 v49.31,85.54 | v54.67,74.74 v54.68,74.75 FB02.P$1
  Bottom 0.203: v73.69,83.36 72.5,82.17 C39.P$2 | v49.31,85.54 51.07,85.54 53,83.61 53,76.41 v54.67,74.74 59.74,74.74 v63.06,78.06
  other vias: 72.5,80.5
DAC_BASE_BOTTOM
  pour Bottom (isolate 0.25): 58.98,72.75 0,72.75 0,89 arc-90 3,92 13.35,92 13.35,83.6 12.85,83.6 arc180 12.85,82.4 13.35,82.4 13.35,78.4 arc180 14.35,78.4 18.65,78.4 arc180 19.65,78.4 19.65,82.4 20.15,82.4 arc180 20.15,83.6 19.65,83.6 19.65,92 85.5,92 85.5,80.75 80.34,75.59 61.82,75.59
DAC_BASE_TOP
  pour Top (isolate 0.25): 58.98,72.75 0,72.75 0,89 arc-90 3,92 13.35,92 13.35,83.6 12.85,83.6 arc180 12.85,82.4 13.35,82.4 13.35,78.4 arc180 14.35,78.4 18.65,78.4 arc180 19.65,78.4 19.65,82.4 20.15,82.4 arc180 20.15,83.6 19.65,83.6 19.65,92 85.5,92 85.5,80.75 80.34,75.59 61.82,75.59
DAC_GND
  Top 0.203: C37.P$1 C36.P$1 78.48,82 77.7,81.22 76,81.22 | 76,81.22 74.76,81.22 73.98,82 C39.P$1 C40.P$1 69.88,82 69.14,81.26 67.5,81.26 | IC5.2 76,81.22 | 67.5,81.26 65.98,81.26 65.24,82 C43.P$1 C44.P$1 60.72,82 60.47,81.75 C33.P$1 | IC6.2 67.5,81.26 | IC4.33 46.25,78.5 IC4.1 45.75,77.8 45.55,78 IC4.32 IC4.31 | IC4.33 49.25,79 IC4.7 49.25,75.76 49.75,75.26 52.93,75.26 53.92,76.25 | IC4.3 47.25,79.5 IC4.33 | C34.P$1 C33.P$1 | 53.92,76.25 C41.P$1 | C42.P$1 54.52,77.75 | 53.92,76.25 53.92,77.15 54.52,77.75 | C33.P$1 FB01.P$1 54.93,80.25 54.52,79.84 54.52,77.75
FMC_A0  (via drill 0.4)
  Top 0.203: v51.74,65.18 49.76,63.2 49.76,60.05 50.01,59.8 50.01,51.82 48.89,50.7 v48.37,50.7 | v61.24,59.63 61.11,59.5 IC1.10 | v28.52,48.06 IC3.23
  Bottom 0.203: v51.74,65.18 51.99,64.93 52.02,64.93 53.44,63.5 53.44,62.22 57.75,57.92 58.82,57.92 60.53,59.63 v61.24,59.63 | v28.52,48.06 29.54,49.08 47.1,49.08 48.37,50.34 v48.37,50.7
FMC_A1  (via drill 0.4)
  Top 0.203: v50.12,50.67 50.37,50.92 50.37,59.95 50.12,60.2 50.12,62.67 51.52,64.07 | 51.52,64.07 | 51.52,64.07 v51.77,64.32 | v63.42,58.21 62.63,59 IC1.11 | v27.89,47.47 28.12,47.25 IC3.24
  Bottom 0.203: v50.12,50.67 49.76,50.67 49.73,50.7 49.23,50.7 47.25,48.72 30.04,48.72 28.77,47.45 28.27,47.45 28.25,47.47 v27.89,47.47 | v51.77,64.32 52.02,64.07 | 52.02,64.07 | 52.02,64.07 53.09,63 53.09,62.08 57.6,57.56 58.97,57.56 59.47,58.06 62.42,58.06 62.56,58.21 v63.42,58.21
FMC_A2  (via drill 0.4)
  Top 0.203: IC1.12 61.91,58.5 v62.81,57.6 | v51.77,63.46 51.52,63.21 | 51.52,63.21 | 51.52,63.21 50.47,62.17 50.47,60.35 50.72,60.09 50.72,50.28 50.51,50.06 49.51,50.06 v49.48,50.09 | v27.27,46.88 27.7,46.45 IC3.25
  Bottom 0.203: v62.81,57.6 62.46,57.6 62.35,57.71 59.62,57.71 59.12,57.21 57.45,57.21 52.73,61.93 52.73,62.5 52.02,63.21 | 52.02,63.21 | 52.02,63.21 v51.77,63.46 | v27.27,46.88 27.63,46.88 27.64,46.87 28.69,46.87 30.19,48.37 47.4,48.37 49.12,50.09 v49.48,50.09
FMC_A3  (via drill 0.4)
  Top 0.203: IC1.13 61.2,58 v62.21,56.99 | v51.77,62.61 51.52,62.36 | 51.52,62.36 | 51.52,62.36 50.83,61.66 50.83,60.49 51.08,60.24 51.08,50.13 50.5,49.56 50.15,49.56 49.83,49.24 v49.47,49.24 | v26.67,46.28 27.29,45.65 IC3.26
  Bottom 0.203: v62.21,56.99 61.85,56.99 61.49,57.35 59.77,57.35 59.27,56.85 57.31,56.85 52.38,61.78 52.38,62 52.02,62.36 | 52.02,62.36 | 52.02,62.36 v51.77,62.61 | v26.67,46.28 27.02,46.28 28.6,46.28 30.33,48.01 47.55,48.01 48.77,49.24 v49.47,49.24
FMC_A4  (via drill 0.4)
  Top 0.203: v49.47,48.38 50.29,49.2 50.65,49.2 51.43,49.99 51.43,60.39 51.18,60.64 51.18,61.16 v51.77,61.75 | v61.6,56.39 61.35,56.64 60.49,57.5 IC1.14 | v39.01,47.24 39.01,46.35 39.71,45.65 IC3.29
  Bottom 0.203: v51.77,61.75 52.02,61.5 52.16,61.5 57.16,56.5 59.41,56.5 59.91,57 60.99,57 61.35,56.64 v61.6,56.39 | v39.01,47.24 39.43,47.66 47.69,47.66 48.42,48.38 v49.47,48.38
FMC_A5  (via drill 0.4)
  Top 0.203: IC1.15 60,57 60.61,56.39 v60.74,56.39 | v51.79,60.89 51.79,49.84 v50.33,48.38 | v39.63,46.65 39.83,46.45 IC3.30
  Bottom 0.203: v60.74,56.39 59.81,56.39 59.56,56.14 57.01,56.14 52.26,60.89 v51.79,60.89 | v50.33,48.38 49.25,47.3 40.28,47.3 v39.63,46.65
FMC_A6  (via drill 0.4)
  Top 0.203: v64.88,49.74 65.58,49.74 67.25,48.07 IC1.50 | v36.89,54.49 36.82,54.42 36.82,50.65 40.22,47.25 IC3.31
  Bottom 0.203: v64.88,49.74 54.36,49.74 50.86,53.24 38.14,53.24 v36.89,54.49
FMC_A7  (via drill 0.4)
  Top 0.203: IC1.53 68.75,47.08 v65.49,50.34 v65.49,50.35 | v37.5,55.09 37.5,54.24 37.18,53.92 37.18,50.8 39.92,48.05 IC3.32
  Bottom 0.203: v65.49,50.35 64.52,50.35 64.27,50.1 54.51,50.1 51.01,53.6 39,53.6 v37.5,55.09
FMC_A8  (via drill 0.4)
  Top 0.203: IC1.54 69.25,47.08 66.09,50.24 66.09,50.6 66.08,50.61 v66.08,50.96 | 38.11,55.34 | 38.11,55.34 v38.11,55.7 | 38.11,55.34 38.11,54.35 37.53,53.77 37.53,50.95 39.63,48.85 IC3.33
  Bottom 0.203: v66.08,50.96 64.6,50.96 64.09,50.45 54.66,50.45 51.16,53.95 39.85,53.95 v38.11,55.7
FMC_A9  (via drill 0.4)
  Top 0.203: IC1.55 69.75,47.08 66.7,50.13 v66.7,51.56 | v38.97,55.77 38.97,54.7 37.89,53.62 37.89,51.09 39.33,49.65 IC3.34
  Bottom 0.203: v66.7,51.56 66.34,51.56 66.33,51.57 64.7,51.57 63.94,50.81 54.8,50.81 51.3,54.31 40.42,54.31 v38.97,55.77
FMC_A10  (via drill 0.4)
  Top 0.203: IC1.56 70.25,47.09 67.31,50.03 v67.31,52.16 | v28.75,49.97 29.87,48.85 IC3.22 | v40.44,55.18 40.44,56.27 39.91,56.8 38.74,56.8 38.24,56.3 37.86,56.3 37.75,56.2 v36.84,56.2
  Bottom 0.203: v67.31,52.16 66.95,52.16 64.78,52.16 63.77,51.16 54.95,51.16 50.45,55.66 40.93,55.66 v40.44,55.18 | v28.75,49.97 28.75,50.42 34.53,56.2 v36.84,56.2
FMC_A11  (via drill 0.4)
  Top 0.203: IC1.57 70.75,47.09 67.93,49.91 v67.93,52.76 | v39.82,55.77 39.82,55.06 38.24,53.48 38.24,51.24 39.03,50.45 IC3.35
  Bottom 0.203: v67.93,52.76 67.57,52.76 67.56,52.77 64.87,52.77 63.62,51.52 55.1,51.52 50.6,56.02 40.07,56.02 v39.82,55.77
FMC_BA0  (via drill 0.4)
  Top 0.203: IC1.89 80.14,54.4 77.8,54.4 76.29,52.9 v75.91,52.9 | v33.99,45.12 33.99,49.98 33.52,50.45 IC3.20
  Bottom 0.203: v75.91,52.9 74.9,51.9 74.9,51.15 68.63,44.87 34.24,44.87 v33.99,45.12
FMC_BA1  (via drill 0.4)
  Top 0.203: IC1.90 77.15,55 v75.91,53.76 | v34.21,50.61 34.21,50.26 34.35,50.13 34.35,45.98 v34.6,45.73 | v33.19,49.68 33.16,49.65 IC3.21
  Bottom 0.203: 75.66,53.51 | 75.66,53.51 v75.91,53.76 | 75.66,53.51 74.55,52.4 74.55,51.3 68.48,45.23 35.1,45.23 v34.6,45.73 | v34.21,50.61 34.12,50.61 v33.19,49.68
FMC_D0  (via drill 0.4)
  Top 0.203: IC1.85 77.26,52.5 v75.95,51.19 | v29.8,64.86 IC3.2
  Bottom 0.203: v75.95,51.19 68.92,44.16 33.79,44.16 31.98,42.35 26.41,42.35 24.67,44.09 24.67,63.32 26.21,64.86 v29.8,64.86
FMC_D1  (via drill 0.4)
  Top 0.203: IC1.86 76.89,53 v75.94,52.05 | v25.9,63.26 IC3.4
  Bottom 0.203: v75.94,52.05 75.26,51.37 75.26,51 68.78,44.52 33.64,44.52 31.83,42.71 26.56,42.71 25.03,44.24 25.03,62.39 v25.9,63.26
FMC_D2  (via drill 0.4)
  Top 0.203: v77.08,68.14 76.83,67.89 76.83,67.86 76.47,67.5 76.12,67.5 75.75,67.14 IC1.114 | v35.27,63.08 34.64,62.45 IC3.5
  Bottom 0.203: v77.08,68.14 76.58,68.64 76.58,70.8 75.77,71.61 51.52,71.61 50.08,70.17 37.12,70.17 35.52,68.57 35.52,63.33 v35.27,63.08
FMC_D3  (via drill 0.4)
  Top 0.203: IC1.115 75.25,67.14 v76.22,68.11 | v34.96,60.85 IC3.7
  Bottom 0.203: v76.22,68.11 76.22,70.65 75.62,71.25 51.67,71.25 50.23,69.81 37.27,69.81 35.88,68.42 35.88,61.77 v34.96,60.85
FMC_D4  (via drill 0.4)
  Top 0.203: IC1.58 71.25,47.09 68.55,49.79 v68.55,53.35 | v33.85,60.05 IC3.8
  Bottom 0.203: v68.55,53.35 68.19,53.35 68.18,53.36 64.97,53.36 63.48,51.87 55.24,51.87 50.74,56.37 38.06,56.37 38.04,56.36 37.54,56.36 v33.85,60.05
FMC_D5  (via drill 0.4)
  Top 0.203: IC1.59 71.75,47.09 69.16,49.68 v69.16,53.94 | v37.79,56.97 37.79,58.33 36.98,59.14 36.18,59.14 35.49,58.45 IC3.10
  Bottom 0.203: v69.16,53.94 68.81,53.94 68.8,53.95 65.06,53.95 63.33,52.23 55.39,52.23 50.89,56.73 39.09,56.73 38.85,56.97 v37.79,56.97
FMC_D6  (via drill 0.4)
  Top 0.203: IC1.60 72.25,47.1 69.78,49.57 v69.78,54.54 | v37.19,57.57 37.19,58.43 36.83,58.78 36.33,58.78 35.19,57.65 IC3.11
  Bottom 0.203: v69.78,54.54 69.42,54.54 69.41,54.55 68.54,54.55 68.3,54.31 64.91,54.31 63.18,52.59 55.54,52.59 51.04,57.09 39.24,57.09 38.75,57.57 v37.19,57.57
FMC_D7  (via drill 0.4)
  Top 0.203: IC1.63 73.75,46.1 70.39,49.47 70.39,54.79 70.38,54.8 v70.38,55.15 | v36.58,58.18 34.45,56.05 IC3.13
  Bottom 0.203: v70.38,55.15 68.64,55.15 68.15,54.66 64.76,54.66 63.04,52.94 55.69,52.94 51.19,57.44 39.38,57.44 38.65,58.18 v36.58,58.18
FMC_D8  (via drill 0.4)
  Top 0.203: IC1.64 74.25,46.1 70.99,49.37 70.99,55.4 70.98,55.41 v70.98,55.77 | v35.44,59.76 35.8,59.76 35.81,59.74 38.3,59.74 38.61,59.43 39.86,59.43 41.18,58.1 41.18,56.98 42.11,56.05 IC3.42
  Bottom 0.203: v70.98,55.77 68.75,55.77 68,55.02 64.61,55.02 62.89,53.3 55.83,53.3 51.33,57.8 39.53,57.8 37.59,59.74 35.81,59.74 35.8,59.76 v35.44,59.76
FMC_D9  (via drill 0.4)
  Top 0.203: IC1.65 74.75,46.11 71.59,49.27 v71.59,56.37 | v36.07,60.35 36.42,60.35 36.46,60.31 38.23,60.31 38.76,59.78 40,59.78 42.14,57.65 IC3.44
  Bottom 0.203: v71.59,56.37 71.23,56.37 68.85,56.37 67.86,55.38 64.47,55.38 62.74,53.65 55.98,53.65 51.48,58.15 39.68,58.15 37.52,60.31 36.46,60.31 36.42,60.35 v36.07,60.35
FMC_D10  (via drill 0.4)
  Top 0.203: IC1.66 75.25,46.11 72.19,49.16 72.19,56.62 v72.19,56.98 | v36.71,60.91 37.07,60.91 37.1,60.88 38.16,60.88 38.9,60.14 40.15,60.14 41.84,58.45 IC3.45
  Bottom 0.203: v72.19,56.98 68.96,56.98 67.71,55.73 64.32,55.73 62.59,54.01 56.13,54.01 51.63,58.51 39.83,58.51 37.45,60.88 37.1,60.88 37.07,60.91 v36.71,60.91
FMC_D11  (via drill 0.4)
  Top 0.203: IC1.67 75.75,46.11 72.8,49.06 v72.8,57.58 | v37.35,61.49 37.7,61.49 37.73,61.46 38.08,61.46 39.05,60.49 40.99,60.49 41.43,60.05 IC3.47
  Bottom 0.203: v72.8,57.58 72.44,57.58 72.44,57.59 69.06,57.59 67.56,56.09 64.17,56.09 62.45,54.36 56.27,54.36 51.77,58.86 39.97,58.86 v37.35,61.49
FMC_D12  (via drill 0.4)
  Top 0.203: IC1.68 76.25,46.12 73.44,48.93 v73.44,58.16 | v37.98,62.07 39.2,60.85 IC3.48
  Bottom 0.203: v73.44,58.16 73.08,58.16 73.05,58.19 69.16,58.19 67.41,56.44 64.02,56.44 62.3,54.72 56.42,54.72 51.92,59.22 40.52,59.22 38.75,60.99 38.75,61.3 v37.98,62.07
FMC_D13  (via drill 0.4)
  Top 0.203: IC1.77 76.39,48.5 75.89,49 75.08,49 74.05,50.03 v74.05,58.75 | v38.61,62.65 40.01,62.65 40.21,62.45 IC3.50
  Bottom 0.203: v74.05,58.75 73.7,58.75 73.69,58.76 73.19,58.76 72.96,58.54 69.01,58.54 67.27,56.8 63.88,56.8 62.15,55.07 56.57,55.07 52.07,59.57 40.67,59.57 39.11,61.13 39.11,62.15 v38.61,62.65
FMC_D14  (via drill 0.4)
  Top 0.203: IC1.78 76.39,49 76.04,49.36 75.64,49.36 74.66,50.34 v74.66,58.15 | v39.21,63.26 IC3.51
  Bottom 0.203: v74.66,58.15 74.66,59 74.3,59.36 73.8,59.36 73.56,59.12 73.04,59.12 72.82,58.9 68.86,58.9 67.12,57.15 63.73,57.15 62.01,55.43 56.72,55.43 52.22,59.93 40.82,59.93 39.46,61.28 39.46,63.01 v39.21,63.26
FMC_D15  (via drill 0.4)
  Top 0.203: IC1.79 76.4,49.5 76.19,49.71 75.85,49.71 75.27,50.3 v75.27,57.54 | v39.83,64.85 IC3.53
  Bottom 0.203: v39.83,64.85 v39.82,64.84 39.82,61.43 40.97,60.28 52.36,60.28 56.86,55.78 61.86,55.78 63.58,57.51 66.97,57.51 68.72,59.25 72.67,59.25 72.89,59.47 73.41,59.47 73.65,59.71 74.45,59.71 75.27,58.9 v75.27,57.54
FMC_NBL0  (via drill 0.4)
  Top 0.203: IC1.141 62.25,63.18 v61.96,62.9 | v37.09,67.12 v37.08,67.12 36.23,67.12 35.98,67.37 31.3,67.37 v31.04,67.12 | v28.85,53.71 29.59,54.45 IC3.15
  Bottom 0.203: v61.96,62.9 61.61,62.9 61.61,62.89 60.97,62.89 60.72,63.14 56.96,63.14 53.42,66.69 52.03,66.69 51.7,67.01 50.72,67.01 50.14,66.43 47.51,66.43 46.57,67.37 37.34,67.37 v37.09,67.12 | v31.04,67.12 31.6,66.57 31.6,62.95 28.51,59.86 28.51,54.05 v28.85,53.71
FMC_NBL1  (via drill 0.4)
  Top 0.203: IC1.142 61.75,63.89 v61.36,63.5 | v49.31,67.12 v49.32,67.11 49.32,54.88 48.09,53.65 IC3.39
  Bottom 0.203: v49.31,67.12 49.56,67.37 51.85,67.37 52.18,67.04 53.57,67.04 57.11,63.5 v61.36,63.5
FMC_SDCKE0  (via drill 0.4)
  Top 0.203: IC1.45 64.75,47.45 v63.65,48.54 | v39.71,52.24 39.9,52.05 IC3.37
  Bottom 0.203: v63.65,48.54 63.17,49.03 54.06,49.03 50.56,52.53 39.99,52.53 v39.71,52.24
FMC_SDCLK  (via drill 0.4)
  Top 0.203: IC1.93 77.76,56.5 v75.88,54.62 | v36.21,51.37 36.23,51.35 v36.23,47.41 | v38.85,52.28 39.42,52.85 IC3.38
  Bottom 0.203: v75.88,54.62 74.19,52.93 74.19,51.44 68.33,45.58 37.52,45.58 36.23,46.87 v36.23,47.41 | v36.21,51.37 37.13,52.28 v38.85,52.28
FMC_SDNCAS  (via drill 0.4)
  Top 0.203: IC1.132 66.75,67.13 v66.48,67.4 | v36.49,67.73 29.28,67.73 v28.69,67.14 | v28.85,52.85 IC3.17
  Bottom 0.203: v66.48,67.4 52.32,67.4 52,67.73 v36.49,67.73 | v28.69,67.14 30.17,67.14 31.24,66.07 31.24,63.1 28.15,60.01 28.15,53.55 v28.85,52.85
FMC_SDNE0  (via drill 0.4)
  Top 0.203: IC1.44 64.25,46.73 v63.04,47.95 | v35.36,51.37 35.24,51.25 IC3.19
  Bottom 0.203: v63.04,47.95 62.31,48.67 53.92,48.67 50.42,52.17 41.02,52.17 39.53,50.68 35.81,50.68 35.36,51.13 v35.36,51.37
FMC_SDNRAS  (via drill 0.4)
  Top 0.203: v36.21,52.89 35.53,52.89 34.69,52.05 IC3.18 | IC1.49 66.75,48.07 65.69,49.13 v64.27,49.13
  Bottom 0.203: v64.27,49.13 63.92,49.13 63.67,49.38 54.21,49.38 50.71,52.88 37.36,52.88 37.35,52.89 v36.21,52.89
FMC_SDNWE  (via drill 0.4)
  Top 0.203: IC1.26 61.35,51.5 62.42,50.43 v62.42,47.35 | v33.76,53.65 IC3.16
  Bottom 0.203: v62.42,47.35 61.45,48.32 53.77,48.32 50.27,51.82 41.17,51.82 39.68,50.32 35.36,50.32 33.76,51.92 v33.76,53.65
GND  (via drill 0.4)
  Top 0.2: FB03.P$2 177.75,83.75 173.25,83.75 C32.P$2 C31.P$2 170.23,83.77 160.54,83.77
  Top 0.203: FB01.P$2 59.35,80.25 63.42,76.17 63.42,75.17 v62.5,74.25 | v101.5,51.5 101.25,51.25 J1.16
  Bottom 0.2: J4.18 J4.17 | J2.6 170.25,80.91 171,81.66 C31.P$2
  Bottom 0.203: S2.3 S2.4
  other vias: 71.18,42.92 71.12,41.17 74.94,42.79 74.7,38.59 70.18,61.58 55.34,61.43 62.63,61.84 64.58,58.15 76.45,57.18 51.73,47.82 51.39,42.09 60.66,46.57 59.73,42.34 77.31,59 83.18,68.07 82.01,54.96 84.02,56.56 92,69.75 86.5,56.75 29.67,56.86 26,55.25 26.5,49.25 41.33,61.68 45.96,54.98 45.22,60.91 45.34,63.71 80.81,43 74.5,36.25 103,79.75 79,18.25 111,20 28.5,62.25 66,70.25 70.5,70.25 48,63.75 107,86.25 107.5,79.25 57.34,59.52 58,69.75 93.5,83 94.99,80.42 99.5,81 111,14.25 53.17,69.19 57.21,64.91 16.5,58 16.5,40 158.5,59 158.5,46 43,12 60,12 161,26.5 95.5,66.5 94.57,52.82 97.5,41 46,50.5 171,83 178,59 177.5,34 173.5,52.5 70.18,59.95 62.83,59.77 50,65 29.5,34.5 78.53,63.65 95,85 81,31.5 161,21 161,15.5 153.5,15.5 161,9 162,5.5 175.5,9 173.5,3 86,47.5 89,47.5 65.5,47.5 67.06,42.95 68.01,46.49
  pour Top (rank 2): 0,89 0,3 arc90 3,0 5.45,0 5.45,8.4 4.95,8.4 arc-180 4.95,9.6 5.45,9.6 5.45,13.6 arc-180 6.45,13.6 10.75,13.6 arc-180 11.75,13.6 11.75,9.6 12.25,9.6 arc-180 12.25,8.4 11.75,8.4 11.75,0 18.95,0 18.95,8.4 18.45,8.4 arc-180 18.45,9.6 18.95,9.6 18.95,13.6 arc-180 19.95,13.6 24.25,13.6 arc-180 25.25,13.6 25.25,9.6 25.75,9.6 arc-180 25.75,8.4 25.25,8.4 25.25,0 164.75,0 164.75,8.4 164.25,8.4 arc-180 164.25,9.6 164.75,9.6 164.75,13.6 arc-180 165.75,13.6 170.05,13.6 arc-180 171.05,13.6 171.05,9.6 171.55,9.6 arc-180 171.55,8.4 171.05,8.4 171.05,0 178.25,0 178.25,8.4 177.75,8.4 arc-180 177.75,9.6 178.25,9.6 178.25,13.6 arc-180 179.25,13.6 183.55,13.6 arc-180 184.55,13.6 184.55,9.6 185.05,9.6 arc-180 185.05,8.4 184.55,8.4 184.55,0 187,0 arc90 190,3 190,89 arc90 187,92 104,92 102.41,93.59 arc45 101.42,94 99.62,94 99.62,87.3 arc-90 99.32,87 arc-90 99.02,87.3 90.98,87.3 arc-90 90.68,87 arc-90 90.38,87.3 90.38,94 88.58,94 arc45 87.59,93.59 86,92 19.65,92 19.65,83.6 20.15,83.6 arc-180 20.15,82.4 19.65,82.4 19.65,78.4 arc-180 18.65,78.4 14.35,78.4 arc-180 13.35,78.4 13.35,82.4 12.85,82.4 arc-180 12.85,83.6 13.35,83.6 13.35,92 3,92 arc90
  pour Bottom (rank 2): 0,89 0,3 arc90 3,0 5.45,0 5.45,8.4 4.95,8.4 arc-180 4.95,9.6 5.45,9.6 5.45,13.6 arc-180 6.45,13.6 10.75,13.6 arc-180 11.75,13.6 11.75,9.6 12.25,9.6 arc-180 12.25,8.4 11.75,8.4 11.75,0 18.95,0 18.95,8.4 18.45,8.4 arc-180 18.45,9.6 18.95,9.6 18.95,13.6 arc-180 19.95,13.6 24.25,13.6 arc-180 25.25,13.6 25.25,9.6 25.75,9.6 arc-180 25.75,8.4 25.25,8.4 25.25,0 164.75,0 164.75,8.4 164.25,8.4 arc-180 164.25,9.6 164.75,9.6 164.75,13.6 arc-180 165.75,13.6 170.05,13.6 arc-180 171.05,13.6 171.05,9.6 171.55,9.6 arc-180 171.55,8.4 171.05,8.4 171.05,0 178.25,0 178.25,8.4 177.75,8.4 arc-180 177.75,9.6 178.25,9.6 178.25,13.6 arc-180 179.25,13.6 183.55,13.6 arc-180 184.55,13.6 184.55,9.6 185.05,9.6 arc-180 185.05,8.4 184.55,8.4 184.55,0 187,0 arc90 190,3 190,89 arc90 187,92 104,92 102.41,93.59 arc45 101.42,94 99.62,94 99.62,87.3 arc-90 99.32,87 arc-90 99.02,87.3 90.98,87.3 arc-90 90.68,87 arc-90 90.38,87.3 90.38,94 88.58,94 arc45 87.59,93.59 86,92 19.65,92 19.65,83.6 20.15,83.6 arc-180 20.15,82.4 19.65,82.4 19.65,78.4 arc-180 18.65,78.4 14.35,78.4 arc-180 13.35,78.4 13.35,82.4 12.85,82.4 arc-180 12.85,83.6 13.35,83.6 13.35,92 3,92 arc90
HP_L
  Top 0.203: J3.2 24.3,80.9 28.95,76.25 R21.P$2
HP_R
  Top 0.203: R20.P$2 36.32,77.75 28.97,85.1 J3.3
HPHONE_L
  Top 0.203: IC4.6 48.75,74.82 47.77,73.84 40.55,73.84 39.25,75.14 R21.P$1
HPHONE_R
  Top 0.203: IC4.2 46.75,75.16 45.79,74.2 42.19,74.2 40.77,75.62 40.77,77.12 40.14,77.75 R20.P$1
HPHONE_VGND  (via drill 0.4)
  Top 0.203: v41.01,78.68 43.11,76.58 v44.88,76.58 | IC4.4 47.75,76.55 v47.6,76.4 | J3.1 37.93,88.1 40.8,85.23 v40.8,84.13
  Bottom 0.203: v40.8,84.13 40.8,78.89 v41.01,78.68 | v47.6,76.4 45.06,76.4 v44.88,76.58
I2C3_SCL  (via drill 0.4)
  Top 0.203: IC1.100 77.84,60 v77.71,59.87 | IC4.29 42.24,80 41.99,80.25 R18.P$2 38.13,79.13 36.47,79.13 34.44,81.16 v34.44,82.67 | v70.13,27.76 73.91,27.76 v74.19,28.03 | v95.95,40.92 95.95,39.02 v95.92,38.99
  Bottom 0.203: v77.71,59.87 77.96,60.12 87.23,60.12 89.48,57.86 89.48,50.73 96.19,44.03 96.19,41.16 v95.95,40.92 | v34.44,82.67 34.44,81.98 22.63,70.18 22.63,32.6 26.72,28.52 68.54,28.52 69.05,28.01 69.88,28.01 v70.13,27.76 | v74.19,28.03 74.31,28.03 74.79,28.51 89.39,28.51 94.92,34.04 94.92,37.48 95.92,38.48 v95.92,38.99
I2C3_SDA  (via drill 0.4)
  Top 0.203: IC1.99 78.55,59.5 v78.32,59.26 | IC4.27 41.71,81 40.96,81.75 R19.P$2 38.51,82.49 37.07,82.49 36.87,82.69 v35.29,82.69 | v73.56,28.61 v70.11,28.61 | v95.09,40.92 95.09,39.02 v95.06,38.99
  Bottom 0.203: v78.32,59.26 78.82,59.77 87.08,59.77 89.13,57.72 89.13,50.59 95.84,43.88 95.84,41.66 95.34,41.17 v95.09,40.92 | v73.56,28.61 73.81,28.86 89.24,28.86 94.54,34.16 94.56,34.19 94.56,38.09 95.06,38.59 v95.06,38.99 | v70.11,28.61 68.95,28.61 68.69,28.87 26.86,28.87 22.99,32.75 22.99,70.03 35.29,82.34 v35.29,82.69
I2S3_CK  (via drill 0.4)
  Top 0.203: v80.37,67.87 80.03,67.53 80.03,65.08 79.75,64.8 77.51,64.8 77.25,65.06 IC1.111 | v44.76,83.01 45.1,83.01 45.41,82.7 IC4.24 | v82.74,74.78 82.11,74.15 v82.11,72.36 | v51.15,73.4 52.86,71.69 62.39,71.69 65.25,74.55 80.79,74.55 v81.2,74.96
  Bottom 0.203: v80.37,67.87 80.37,70.61 v82.11,72.36 | v82.74,74.78 81.38,74.78 v81.2,74.96 | v44.76,83.01 45.4,83.65 48.95,83.65 51.39,81.2 51.39,73.64 v51.15,73.4
I2S3_MCK  (via drill 0.4)
  Top 0.203: IC1.97 78.37,58.5 v78.28,58.41 | v72.95,29.22 v69.52,29.22 v69.51,29.23 | v35.9,84.47 35.9,83.61 36.26,83.25 R22.P$2 | v94.24,40.92 94.24,39.02 v94.21,38.99
  Bottom 0.203: v78.28,58.41 78.53,58.66 78.57,58.66 79.32,59.41 86.93,59.41 88.77,57.57 88.77,50.44 95.48,43.73 95.48,42.16 94.49,41.17 v94.24,40.92 | v72.95,29.22 89.09,29.22 94.21,34.34 v94.21,38.99 | v69.51,29.23 27.01,29.23 23.34,32.9 23.34,69.89 35.9,82.44 v35.9,84.47
I2S3_MCK_IN
  Top 0.203: R22.P$1 41.78,83.25 44.53,86 46.42,86 47.75,84.67 IC4.21
I2S3_SDI  (via drill 0.4)
  Top 0.203: IC1.112 76.75,66.77 77.15,67.18 77.48,67.18 78.77,68.48 80.97,68.48 v81.19,68.26 | v82.97,72.36 83.72,73.11 83.72,75.01 v83.34,75.39 | 81.45,75.56 80.95,75.56 80.29,74.91 65.1,74.91 62.24,72.05 53.01,72.05 52.34,72.71 52.34,73.12 v52.01,73.45 | v81.81,75.56 81.45,75.56 | 81.45,75.56 | IC4.25 44.55,82 v44.17,82.38
  Bottom 0.203: v81.19,68.26 80.72,68.73 80.72,70.47 82.01,71.75 82.36,71.75 82.72,72.1 | 82.72,72.1 | 82.72,72.1 v82.97,72.36 | v83.34,75.39 82.99,75.39 | 82.99,75.39 | v81.81,75.56 81.98,75.39 82.99,75.39 | v44.17,82.38 43.83,82.73 43.83,83.01 44.82,84 49.09,84 51.74,81.35 51.74,75.67 52.01,75.41 v52.01,73.45
I2S3_SDO  (via drill 0.4)
  Top 0.203: IC1.113 76.25,67.03 76.37,67.15 76.62,67.15 77.01,67.53 77.33,67.53 78.66,68.86 81.8,68.86 v82.05,68.61 | v81.2,76.17 80.95,75.92 80.8,75.92 80.14,75.26 64.95,75.26 62.09,72.4 53.96,72.4 v52.86,73.5 | v43.59,81.75 43.84,81.5 IC4.26 | v83.95,75.99 84.5,75.44 84.5,72.67 v83.61,71.79
  Bottom 0.203: v82.05,68.61 81.84,68.61 81.08,69.37 81.08,70.32 82.15,71.39 82.86,71.39 83.26,71.79 v83.61,71.79 | v83.95,75.99 83.59,75.99 83.42,76.17 v81.2,76.17 | v43.59,81.75 43.47,81.87 43.47,83.16 44.67,84.36 49.24,84.36 52.1,81.5 52.1,75.82 52.36,75.56 52.36,74 v52.86,73.5
I2S3_WS  (via drill 0.4)
  Top 0.203: IC1.40 62.25,46.14 v62.61,46.49 | v51.06,46.19 51.06,43.53 v52.77,41.82 | IC4.23 46.75,84.81 v46.54,85.03
  Bottom 0.203: v62.61,46.49 62.36,46.49 61.81,45.94 51.31,45.94 v51.06,46.19 | v52.77,41.82 52.77,39.58 51.63,38.44 28.2,38.44 23.7,42.94 23.7,69.74 38.99,85.03 v46.54,85.03
LCD_BL
  Top 0.203: IC1.129 68.25,66.89 69,67.64 R9.P$2
LCD_CS  (via drill 0.4)
  Top 0.203: IC1.116 74.75,68.79 75.53,69.57 86.44,69.57 87.99,68.02 87.99,59.93 89.94,57.99 89.94,56.56 90.64,55.86 | 90.64,55.86 | 90.64,55.86 v90.89,55.61 | v95.46,47.89 95.82,47.89 95.83,47.88 96.33,47.88 97.2,48.75 J1.11
  Bottom 0.203: v90.89,55.61 91.14,55.86 91.52,55.86 92.49,56.82 99.44,56.82 102.63,53.63 102.63,48.55 101.97,47.88 95.83,47.88 95.82,47.89 v95.46,47.89
LCD_D0  (via drill 0.4)
  Top 0.203: v68.03,39.07 68,39.1 66.7,39.1 65.25,40.55 IC1.46 | v105.7,59.3 105.7,59.97 104.42,61.25 J1.36
  Bottom 0.203: v68.03,39.07 68.56,39.6 98.47,39.6 100.31,37.76 102.16,37.76 103.68,39.28 103.68,39.97 104.03,40.32 104.78,40.32 105.78,41.32 105.78,59.23 v105.7,59.3
LCD_D1  (via drill 0.4)
  Top 0.203: v67.46,39.7 66.6,39.7 65.75,40.55 IC1.47 | v105.1,58.7 105.1,59.83 104.18,60.75 J1.35
  Bottom 0.203: v67.46,39.7 67.71,39.95 98.62,39.95 100.46,38.11 102.01,38.11 103.32,39.43 103.32,40.11 103.89,40.68 104.63,40.68 105.42,41.47 105.42,58.37 v105.1,58.7
LCD_D2  (via drill 0.4)
  Top 0.203: IC1.48 66.25,40.91 v66.85,40.31 | v104.49,58.09 104.49,59.64 103.88,60.25 J1.34
  Bottom 0.203: v104.49,58.09 105.07,57.51 105.07,41.62 104.49,41.03 103.74,41.03 102.97,40.26 102.97,39.57 101.86,38.47 100.61,38.47 99.24,39.84 99.24,39.86 98.79,40.31 v66.85,40.31
LCD_D3  (via drill 0.4)
  Top 0.203: IC1.133 66.25,64.78 v66.66,64.37 | v93.44,66.97 94.1,66.31 94.1,60.11 94.46,59.75 J1.33
  Bottom 0.203: v66.66,64.37 69.38,67.09 90.51,67.09 91.33,67.91 92.5,67.91 v93.44,66.97
LCD_D4  (via drill 0.4)
  Top 0.203: IC1.134 65.75,64.42 66.41,63.76 66.91,63.76 66.94,63.8 v67.3,63.8 | v92.59,66.95 93.75,65.79 93.75,59.96 94.46,59.25 J1.32
  Bottom 0.203: v92.59,66.95 91.98,67.56 91.48,67.56 90.66,66.73 69.53,66.73 67.55,64.76 67.55,64.05 v67.3,63.8
LCD_D5  (via drill 0.4)
  Top 0.203: IC1.135 65.25,64.09 66.18,63.16 v66.72,63.16 | v91.73,66.95 93.39,65.29 93.39,59.81 94.45,58.75 J1.31
  Bottom 0.203: v91.73,66.95 91.48,66.7 91.47,66.7 91.15,66.38 69.67,66.38 67.91,64.61 67.91,63.55 67.52,63.16 v66.72,63.16
LCD_D6  (via drill 0.4)
  Top 0.203: IC1.136 64.75,63.74 65.94,62.55 v67.33,62.55 | v91.72,66.09 93.04,64.78 93.04,59.66 94.45,58.25 J1.30
  Bottom 0.203: v91.72,66.09 91.65,66.02 69.82,66.02 68.26,64.46 68.26,63.35 67.46,62.55 v67.33,62.55
LCD_D7  (via drill 0.4)
  Top 0.203: v91.72,65.23 92.68,64.27 92.68,59.52 94.45,57.75 J1.29 | IC1.137 64.25,63.73 66.04,61.94 v66.7,61.94
  Bottom 0.203: v91.72,65.23 91.29,65.67 69.97,65.67 68.62,64.31 68.62,62.98 67.58,61.94 v66.7,61.94
LCD_D8  (via drill 0.4)
  Top 0.203: v91.72,64.38 92.33,63.77 92.33,59.37 94.45,57.25 J1.28 | IC1.139 63.25,64.23 66.14,61.34 v67.31,61.34
  Bottom 0.203: v91.72,64.38 90.79,65.31 70.12,65.31 68.97,64.17 68.97,62.84 67.72,61.59 67.56,61.59 v67.31,61.34
LCD_D9  (via drill 0.4)
  Top 0.203: IC1.140 62.75,64.23 66.25,60.73 v66.7,60.73 | v91.72,63.52 91.97,63.27 91.97,59.22 94.44,56.75 J1.27
  Bottom 0.203: v91.72,63.52 90.28,64.96 70.26,64.96 69.33,64.02 69.33,62.69 67.91,61.27 67.91,61.09 67.56,60.73 v66.7,60.73
LCD_D10  (via drill 0.4)
  Top 0.203: IC1.69 76.75,43.44 76.6,43.3 76.25,43.3 75.89,42.94 75.89,42.44 76.25,42.08 76.26,42.08 v76.51,41.83 | v93.06,50.02 93.05,50.03 87.77,50.03 v86.99,50.82 | v96.2,55.86 96.59,56.25 J1.26
  Bottom 0.203: v76.51,41.83 76.54,41.86 77.17,41.86 78.57,43.26 78.57,46.73 78.28,47.02 78.28,47.73 77.67,48.34 77.67,49.53 78.12,49.98 81.38,49.98 82.8,51.4 86.4,51.4 v86.99,50.82 | v96.2,55.86 96.2,53.16 v93.06,50.02
LCD_D11  (via drill 0.4)
  Top 0.203: IC1.70 77.25,43.44 v76.5,42.69 | v87.16,52.26 87.41,52.01 87.44,52.01 88.83,50.62 92.09,50.62 92.11,50.64 v92.46,50.64 | v93.57,55.65 94.12,55.65 94.56,55.21 96.41,55.21 96.95,55.75 J1.25
  Bottom 0.203: v76.5,42.69 78.22,44.41 78.22,46.58 77.92,46.88 77.92,47.58 77.31,48.19 77.31,49.68 77.97,50.34 81.23,50.34 83.15,52.26 v87.16,52.26 | v92.46,50.64 93.57,51.75 v93.57,55.65
LCD_D12  (via drill 0.4)
  Top 0.203: IC1.73 77.78,46.5 v77.61,46.33 | v91.84,51.22 91.48,51.22 91.45,51.19 90.94,51.19 89.02,53.12 v87.13,53.12 | v92.96,55.05 93.32,55.05 94.22,55.05 94.42,54.85 96.56,54.85 96.95,55.25 J1.24
  Bottom 0.203: v77.61,46.33 77.56,46.38 77.56,47.44 76.96,48.04 76.96,49.83 77.82,50.69 81.08,50.69 83.51,53.12 v87.13,53.12 | v92.96,55.05 92.96,53.86 92.98,53.85 92.98,52.36 v91.84,51.22
LCD_D13  (via drill 0.4)
  Top 0.203: IC1.74 77.06,47 v76.96,46.89 | v87.1,53.98 88.97,53.98 91.15,51.8 v91.2,51.8 | v92.35,54.45 92.7,54.45 92.71,54.45 93.96,54.45 94.01,54.5 96.7,54.5 96.95,54.75 J1.23
  Bottom 0.203: v76.96,46.89 76.96,47.54 76.6,47.9 76.6,49.98 77.67,51.05 80.94,51.05 83.86,53.98 v87.1,53.98 | v91.2,51.8 91.2,53.3 v92.35,54.45
LCD_D14  (via drill 0.4)
  Top 0.203: v76.25,47.39 76.35,47.5 IC1.75 | v87.07,54.83 88.61,54.83 90.81,52.63 91.57,52.63 v91.82,52.38 | v92.37,53.6 93.61,53.6 94.16,54.14 96.85,54.14 96.96,54.25 J1.22
  Bottom 0.203: v87.07,54.83 84.22,54.83 80.79,51.4 77.53,51.4 76.25,50.12 v76.25,47.39 | v91.82,52.38 91.82,53.05 v92.37,53.6
LCD_D15  (via drill 0.4)
  Top 0.203: v75.63,47.99 v75.64,48 IC1.76 | v87.07,55.69 88.26,55.69 90.96,52.99 92.74,52.99 92.99,53.24 93.76,53.24 94.31,53.79 96.93,53.79 96.97,53.75 J1.21